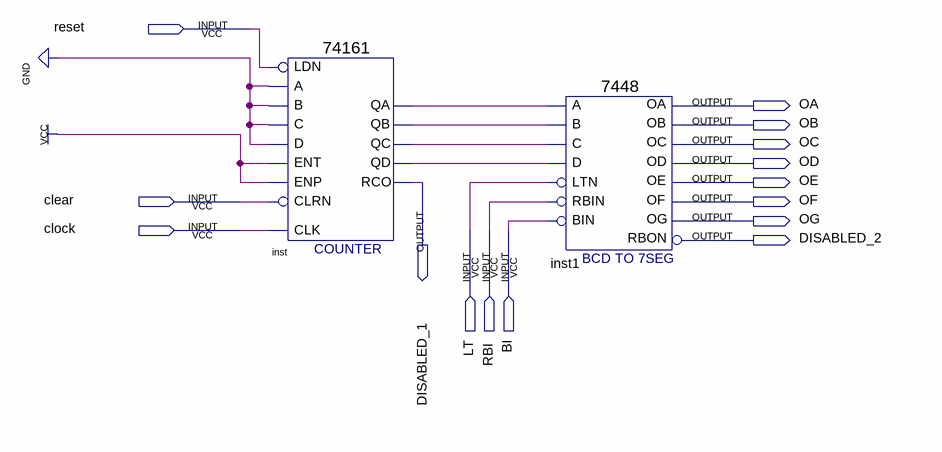
[diagram p0: schematic sheet]
// Quartus schematic experiment6.bdf as structural Verilog: 2 symbols, 15 pins
module experiment6 (
  input  reset,
  input  clear,
  input  clock,
  input  LT,
  input  RBI,
  input  BI,
  output OA,
  output OB,
  output OC,
  output OD,
  output DISABLED_1,
  output OE,
  output OF,
  output OG,
  output DISABLED_2
);

  wire inst_qa, inst_qb, inst_qc, inst_qd;

  \74161  inst (
    .CLRN(clear), .CLK(clock), .ENP(1'b1), .LDN(reset), .A(1'b0), .D(1'b0), .ENT(1'b1), .B(1'b0), .C(1'b0),
    .QD(inst_qd), .QC(inst_qc), .QB(inst_qb), .QA(inst_qa), .RCO(DISABLED_1));
  \7448  inst1 (
    .A(inst_qa), .C(inst_qc), .D(inst_qd), .B(inst_qb), .RBIN(RBI), .BIN(BI), .LTN(LT), .OC(OC), .OE(OE),
    .OD(OD), .OF(OF), .OG(OG), .OB(OB), .OA(OA), .RBON(DISABLED_2));
endmodule
